# Altium schematic sheet FrantPannel.SchDoc
size A4; Organization: Altium Limited; Address1: L3, 12a Rodborough Rd; Address2: Frenchs Forest; Address3: NSW; Address4: Australia 2086
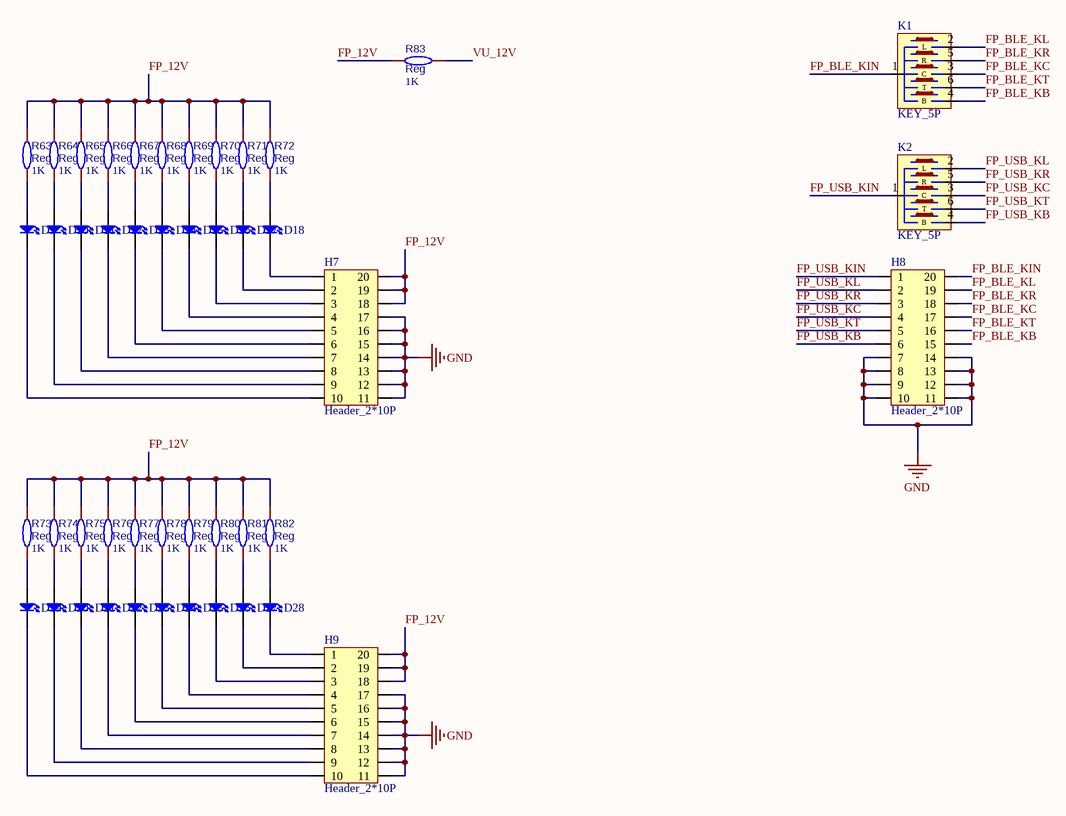
[diagram p0: FrantPannel.SchDoc]

## Parts
D9  LED  [LED0603]  (value not drawn)
D10  LED  [LED0603]  (value not drawn)
D11  LED  [LED0603]  (value not drawn)
D12  LED  [LED0603]  (value not drawn)
D13  LED  [LED0603]  (value not drawn)
D14  LED  [LED0603]  (value not drawn)
D15  LED  [LED0603]  (value not drawn)
D16  LED  [LED0603]  (value not drawn)
D17  LED  [LED0603]  (value not drawn)
D18  LED  [LED0603]  (value not drawn)
D19  LED  [LED0603]  (value not drawn)
D20  LED  [LED0603]  (value not drawn)
D21  LED  [LED0603]  (value not drawn)
D22  LED  [LED0603]  (value not drawn)
D23  LED  [LED0603]  (value not drawn)
D24  LED  [LED0603]  (value not drawn)
D25  LED  [LED0603]  (value not drawn)
D26  LED  [LED0603]  (value not drawn)
D27  LED  [LED0603]  (value not drawn)
D28  LED  [LED0603]  (value not drawn)
H7  Header_2*10P  [H_2.0_2x10Pin_SMD]
H8  Header_2*10P  [H_2.0_2x10Pin_SMD]
H9  Header_2*10P  [H_2.0_2x10Pin_SMD]
K1  KEY_5P  [KEY_5]
K2  KEY_5P  [KEY_5]
R63  Reg  value 1K  [R0603]
R64  Reg  value 1K  [R0603]
R65  Reg  value 1K  [R0603]
R66  Reg  value 1K  [R0603]
R67  Reg  value 1K  [R0603]
R68  Reg  value 1K  [R0603]
R69  Reg  value 1K  [R0603]
R70  Reg  value 1K  [R0603]
R71  Reg  value 1K  [R0603]
R72  Reg  value 1K  [R0603]
R73  Reg  value 1K  [R0603]
R74  Reg  value 1K  [R0603]
R75  Reg  value 1K  [R0603]
R76  Reg  value 1K  [R0603]
R77  Reg  value 1K  [R0603]
R78  Reg  value 1K  [R0603]
R79  Reg  value 1K  [R0603]
R80  Reg  value 1K  [R0603]
R81  Reg  value 1K  [R0603]
R82  Reg  value 1K  [R0603]
R83  Reg  value 1K  [R0603]

## Nets
GND: H7.11 H7.12 H7.13 H7.14 H7.15 H7.16 H7.17 H8.7 H8.8 H8.9 H8.10 H8.11 H8.12 H8.13 H8.14 H9.11 H9.12 H9.13 H9.14 H9.15 H9.16 H9.17
FP_12V: H7.18 H7.19 H7.20 H9.18 H9.19 H9.20 R63.2 R64.2 R65.2 R66.2 R67.2 R68.2 R69.2 R70.2 R71.2 R72.2 R73.2 R74.2 R75.2 R76.2 R77.2 R78.2 R79.2 R80.2 R81.2 R82.2 R83.2
FP_BLE_KB: H8.15 K1.4(B)
FP_BLE_KC: H8.17 K1.3(C)
FP_BLE_KIN: H8.20 K1.1(G)
FP_BLE_KL: H8.19 K1.2(L)
FP_BLE_KR: H8.18 K1.5(R)
FP_BLE_KT: H8.16 K1.6(T)
FP_USB_KB: H8.6 K2.4(B)
FP_USB_KC: H8.4 K2.3(C)
FP_USB_KIN: H8.1 K2.1(G)
FP_USB_KL: H8.2 K2.2(L)
FP_USB_KR: H8.3 K2.5(R)
FP_USB_KT: H8.5 K2.6(T)
VU_12V: R83.1
NetD9_1: D9.1(K) H7.10
NetD9_2: D9.2(A) R63.1
NetD10_1: D10.1(K) H7.9
NetD10_2: D10.2(A) R64.1
NetD11_1: D11.1(K) H7.8
NetD11_2: D11.2(A) R65.1
NetD12_1: D12.1(K) H7.7
NetD12_2: D12.2(A) R66.1
NetD13_1: D13.1(K) H7.6
NetD13_2: D13.2(A) R67.1
NetD14_1: D14.1(K) H7.5
NetD14_2: D14.2(A) R68.1
NetD15_1: D15.1(K) H7.4
NetD15_2: D15.2(A) R69.1
NetD16_1: D16.1(K) H7.3
NetD16_2: D16.2(A) R70.1
NetD17_1: D17.1(K) H7.2
NetD17_2: D17.2(A) R71.1
NetD18_1: D18.1(K) H7.1
NetD18_2: D18.2(A) R72.1
NetD19_1: D19.1(K) H9.10
NetD19_2: D19.2(A) R73.1
NetD20_1: D20.1(K) H9.9
NetD20_2: D20.2(A) R74.1
NetD21_1: D21.1(K) H9.8
NetD21_2: D21.2(A) R75.1
NetD22_1: D22.1(K) H9.7
NetD22_2: D22.2(A) R76.1
NetD23_1: D23.1(K) H9.6
NetD23_2: D23.2(A) R77.1
NetD24_1: D24.1(K) H9.5
NetD24_2: D24.2(A) R78.1
NetD25_1: D25.1(K) H9.4
NetD25_2: D25.2(A) R79.1
NetD26_1: D26.1(K) H9.3
NetD26_2: D26.2(A) R80.1
NetD27_1: D27.1(K) H9.2
NetD27_2: D27.2(A) R81.1
NetD28_1: D28.1(K) H9.1
NetD28_2: D28.2(A) R82.1

## Notes on the sheet
- Title
- Size:
- Date:
- A4
- Number:
- Time:
- Revision:
- Sheet
- of
- File:

## Library data of the parts
D9-D28 = LED0: Published: 8-Jun-2000; LatestRevisionDate: 08-Jul-2005; LatestRevisionNote: Mech Layer 1 removed.; PackageReference: LED-0; Publisher: Altium Limited; PackageDescription: LED; 2 Leads
H7-H9 = Header_2*10P: 2*10P连接器
K1 K2 = KEY_5P: 五向开关
R63-R83 = Res: 电阻; BOM_Manufacturer: Viking Tech; BOM_Manufacturer Part: AR03BTCX1002A; nameAlias: Resistance (Ohms); Contributor: LCSC; BOM_Supplier: LCSC; BOM_Supplier Part: C465721; spicePre: R; spiceSymbolName: AR03BTCX1002A